# EAGLE design DUAL CHANNEL REAY DRIVER (EAGLE 6.1)
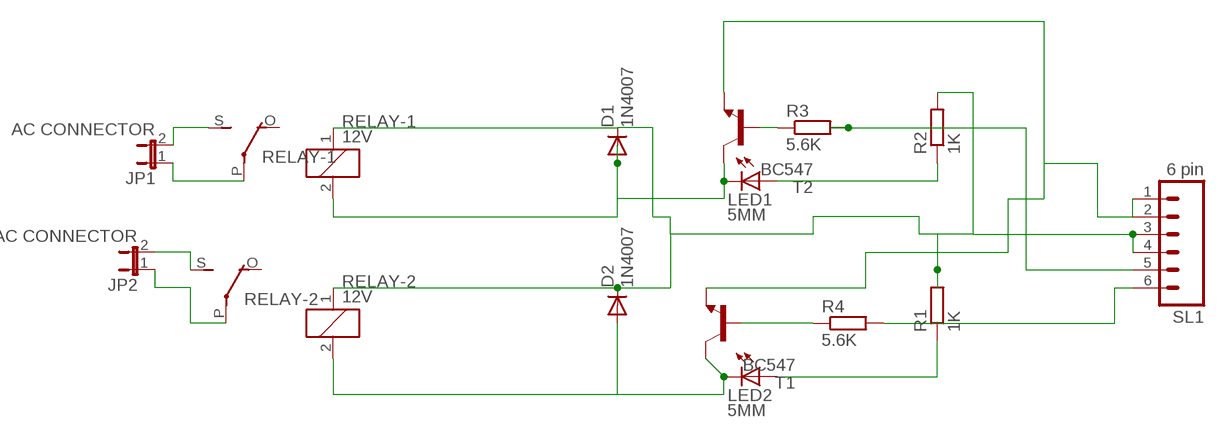
[diagram p0: schematic, sheet 1]

## Parts
D1  1N4007  1N4004  [DO41-10]
D2  1N4007  1N4004  [DO41-10]
JP1  AC CONNECTOR  JP1E  [JP1]
JP2  AC CONNECTOR  JP1E  [JP1]
LED1  5MM  LED5MM  [LED5MM]
LED2  5MM  LED5MM  [LED5MM]
R1  1K  R-EU_0204/7  [0204/7]
R2  1K  R-EU_0204/7  [0204/7]
R3  5.6K  R-EU_0204/7  [0204/7]
R4  5.6K  R-EU_0204/7  [0204/7]
RELAY-1  12V  G5L  [G5LE]
RELAY-2  12V  G5L  [G5LE]
SL1  6 pin  M06  [06P]
T1  BC547  [TO92]
T2  BC547  [TO92]

## Nets
N$1: D1.A LED1.K(C) RELAY-1.2 T2.3(C)
N$2: D1.C D2.C R1.2 R2.2 RELAY-1.1 RELAY-2.1 SL1.3 SL1.4
N$3: JP2.2 RELAY-2.S(2:S)
N$5: R4.1 T1.2(B)
N$6: R3.1 T2.2(B)
N$7: LED1.A R2.1
N$8: LED2.A R1.1
N$9: JP1.2 RELAY-1.S(2:S)
N$10: JP1.1 RELAY-1.P(2:P)
N$13: JP2.1 RELAY-2.P(2:P)
N$16: SL1.1 SL1.2 T1.1(E) T2.1(E)
N$17: R3.2 SL1.5
N$18: R4.2 SL1.6
N$20: D2.A LED2.K(C) RELAY-2.2 T1.3(C)
Unconnected: RELAY-1.O(2:O) RELAY-2.O(2:O)

## Library data of the parts
D1 D2 = diode:1N4004: DIODE general purpose rectifier, 1 A
JP1 JP2 = jumper:JP1E: JUMPER
LED1 LED2 = led:LED: LED OSRAM: - CHIPLED LG R971, LG N971, LY N971, LG Q971, LY Q971, LO R971, LY R971 LH N974, LH R974 LS Q976, LO Q976, LY Q976 LO Q996 - Hyper CHIPLED LW Q18S LB Q993, LB Q99A, LB R99A - SideLED LS A670, LO A670, LY A670, LG A670, LP A670 LB A673, LV A673, LT A673, LW A673 LH A674 LY A675 LS A676, LA A676, LO A676, LY A676, LW A676 LS A679, LY A679, LG A679 - Hyper Micro SIDELED® LS Y876, LA Y876, LO Y876, LY Y876 LT Y87S - SmartLED LW L88C, LW L88S LB L89C, LB L89S, LG L890 LS L89K, LO L89K, LY L89K LS L896, LA L896, LO L896, LY L896 - TOPLED LS T670, LO T670, LY T670, LG T670, LP T670 LSG T670, LSP T670, LSY T670, LOP T670, LYG T670 LG T671, LOG T671, LSG T671 LB T673, LV T673, LT T673, LW T673 LH T674 LS T676, LA T676, LO T676, LY T676, LB T676, LH T676, LSB T676, LW T676 LB T67C, LV T67C, LT T67C, LS T67K, LO T67K, LY T67K, LW E67C LS E67B, LA E67B, LO E67B, LY E67B, LB E67C, LV E67C, LT E67C LW T67C LS T679, LY T679, LG T679 LS T770, LO T770, LY T770, LG T770, LP T770 LB T773, LV T773, LT T773, LW T773 LH T774 LS E675, LA E675, LY E675, LS T675 LS T776, LA T776, LO T776, LY T776, LB T776 LHGB T686 LT T68C, LB T68C - Hyper Mini TOPLED® LB M676 - Mini TOPLED Santana® LG M470 LS M47K, LO M47K, LY M47K Source: http://www.osram.convergy.de LUXEON: - LUMILED® LXK2-PW12-R00, LXK2-PW12-S00, LXK2-PW14-U00, LXK2-PW14-V00 LXK2-PM12-R00, LXK2-PM12-S00, LXK2-PM14-U00 LXK2-PE12-Q00, LXK2-PE12-R00, LXK2-PE12-S00, LXK2-PE14-T00, LXK2-PE14-U00 LXK2-PB12-K00, LXK2-PB12-L00, LXK2-PB12-M00, LXK2-PB14-N00, LXK2-PB14-P00, LXK2-PB14-Q00 LXK2-PR12-L00, LXK2-PR12-M00, LXK2-PR14-Q00, LXK2-PR14-R00 LXK2-PD12-Q00, LXK2-PD12-R00, LXK2-PD12-S00 LXK2-PH12-R00, LXK2-PH12-S00 LXK2-PL12-P00, LXK2-PL12-Q00, LXK2-PL12-R00 Source: www.luxeon.com KINGBRIGHT: KA-3528ASYC Source: www.kingbright.com
R1-R4 = rcl:R-EU_: RESISTOR, European symbol
RELAY-1 RELAY-2 = relay:G5L: RELAY 1 x switch, 10 A/120 V AC, 8 A/30 V ADC, Omron; OC_FARNELL: unknown; OC_NEWARK: unknown
SL1 = con-amp-quick:M06: AMP QUICK CONNECTOR; OC_FARNELL: unknown; OC_NEWARK: unknown
T1 T2 = transistor:BC547: NPN TRANSISTOR

## Board
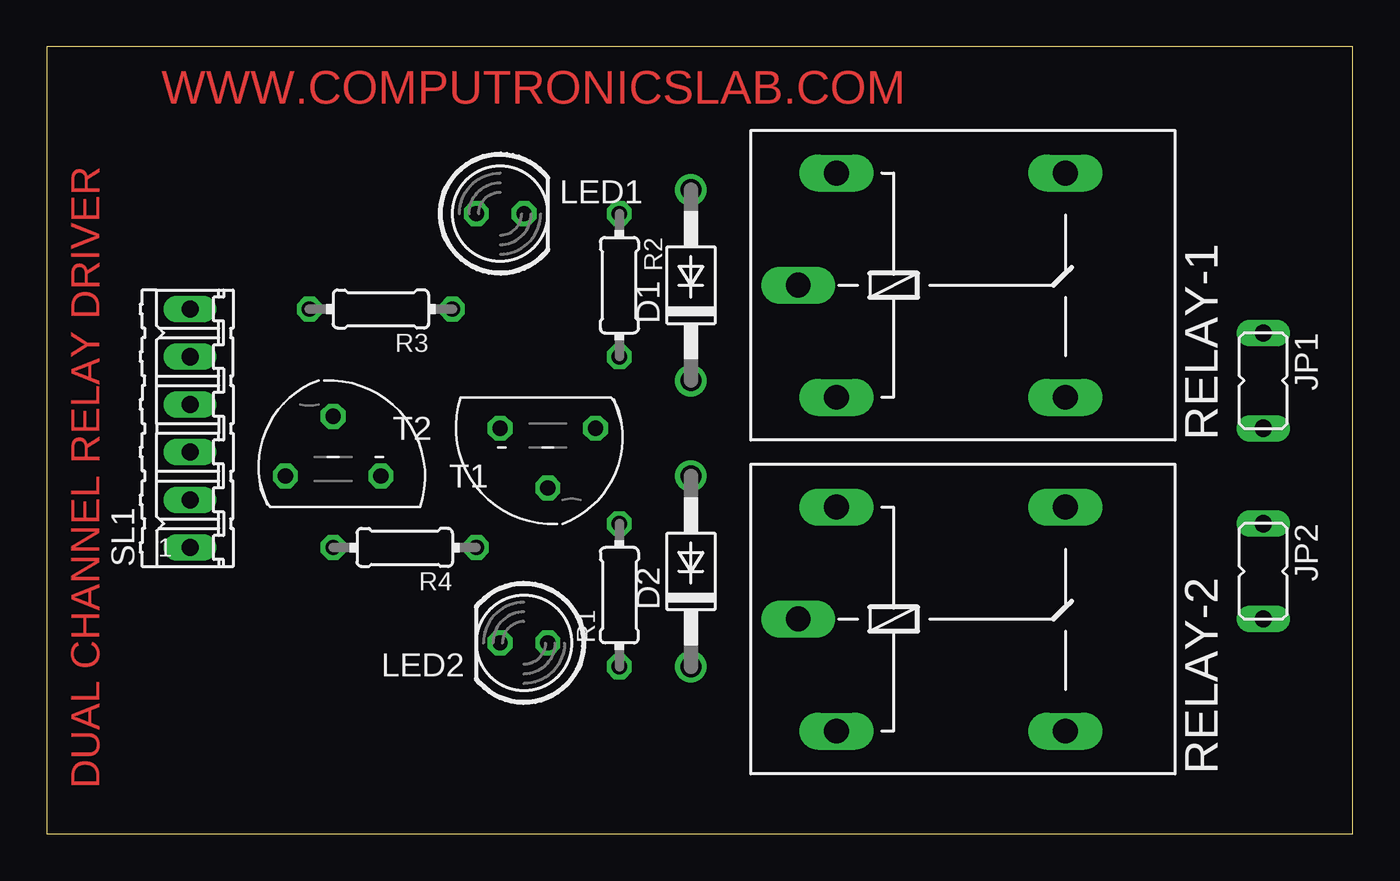
[diagram p1: board, top side]
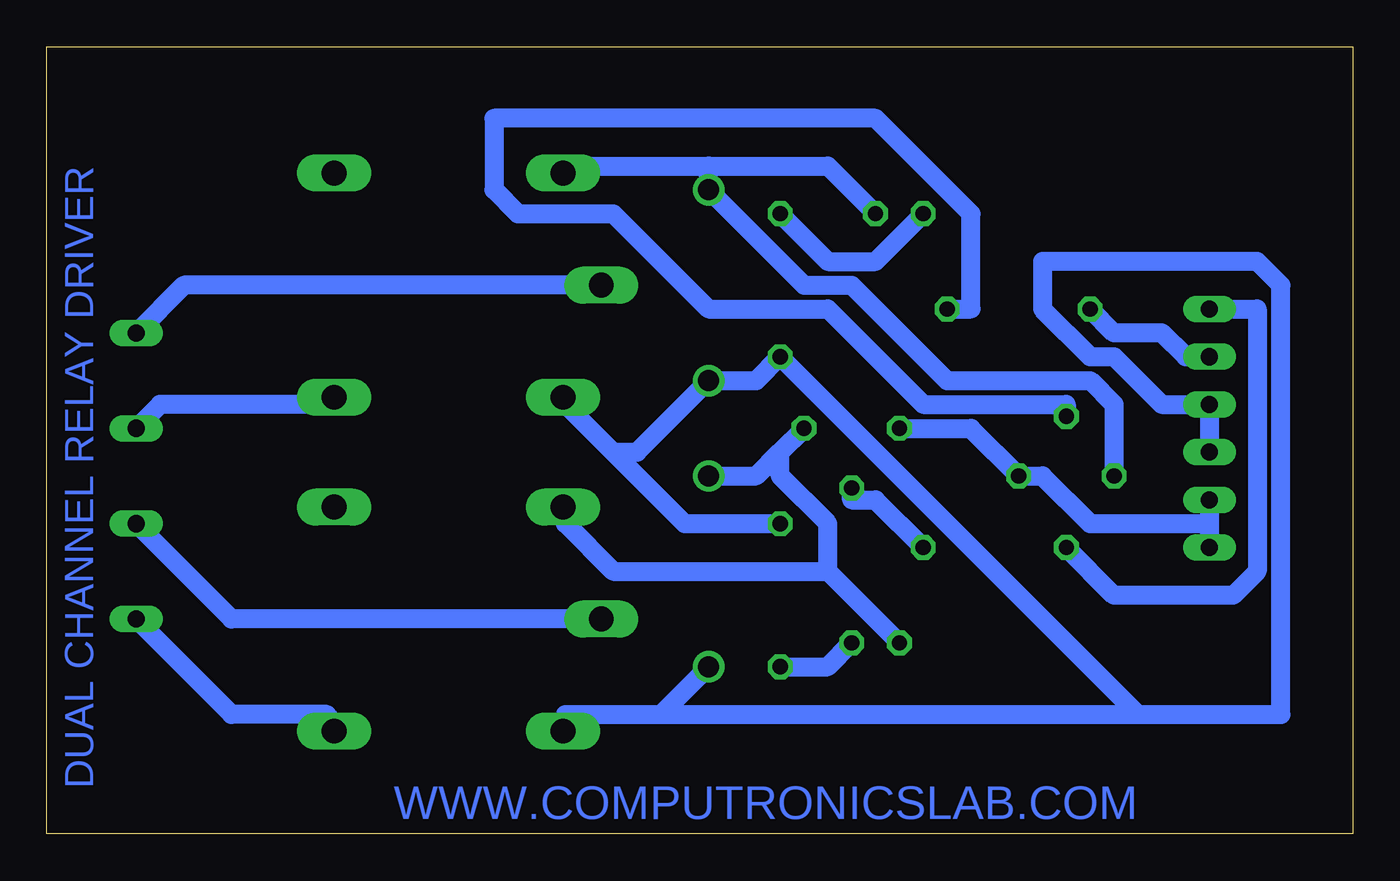
[diagram p2: board, bottom side, seen from below]

Size 69.52 x 41.9 mm. Coordinates in mm from the lower left corner, seen from the top.
Outline: 0,0 69.52,0 69.52,41.9 0,41.9 0,0
Copper layers (1*16): Top 0.035mm / dielectric 1.5mm / Bottom 0.035mm
Design rules: minimum track width 40mil, minimum drill 24mil, track to track 8mil, track to pad 8mil, pad to pad 8mil, via to via 8mil, smd to smd 8mil, copper to edge 40mil, drill to drill 8mil, minimum pad ring 10mil, minimum via ring 8mil, stop-mask expansion 4mil, vias tented up to drill 0mil, thermal gap 10mil

### Footprints (pad centres in the part's own frame; a part is rotated, then mirrored left to right if it is on the bottom)
DO41-10 = drill 1.118: A 5.08,0; C -5.08,0
JP1 = drill 0.914 long: 1 0,-2.54; 2 0,2.54
LED5MM = drill 0.813 octagon: A -1.27,0; K 1.27,0
0204/7 = drill 0.813 octagon: 1 -3.81,0; 2 3.81,0
G5LE = drill 1.321 long: 1 -7.493,-5.969; 2 -7.493,5.969; O 4.699,5.969; P -9.525,0; S 4.699,-5.969
06P = drill 0.914 long: 1 -6.35,0; 2 -3.81,0; 3 -1.27,0; 4 1.27,0; 5 3.81,0; 6 6.35,0
TO92 = drill 0.813 octagon: 1 2.54,-1.27; 2 0,1.905; 3 -2.54,-1.27

### Placement (x,y rotation side)
D1  34.29,29.21 90 top
D2  34.29,13.97 90 top
JP1  64.77,24.13 180 top
JP2  64.77,13.97 180 top
LED1  24.13,33.02 0 top
LED2  25.4,10.16 180 top
R1  30.48,12.7 90 top
R2  30.48,29.21 270 top
R3  17.78,27.94 180 top
R4  19.05,15.24 180 top
RELAY-1  49.53,29.21 0 top
RELAY-2  49.53,11.43 0 top
SL1  7.62,21.59 90 top
T1  26.67,20.32 180 top
T2  15.24,20.32 0 top

### Tracks (layer width: path | path; a pad name or v marks a point on that pad's centre or on a via)
N$1
  Bottom 1.016: LED1.K 27.94,35.56 34.29,35.56 | 34.29,35.56 41.91,35.56 RELAY-1.2 | T2.3 12.7,22.86 13.97,24.13 21.59,24.13 26.67,29.21 29.21,29.21 D1.A 34.29,35.56
N$2
  Bottom 1.016: R1.2 35.56,16.51 39.37,20.32 | 39.37,20.32 41.91,22.86 RELAY-1.1 | 39.37,20.32 38.1,20.32 D1.C 31.75,24.13 R2.2 11.43,6.35 | SL1.3 SL1.4 10.16,22.86 12.7,25.4 13.97,25.4 16.51,27.94 16.51,30.48 5.08,30.48 3.81,29.21 3.81,6.35 11.43,6.35 | 36.83,6.35 D2.C | 36.83,6.35 41.91,6.35 RELAY-2.1 | 36.83,6.35 11.43,6.35
N$3
  Bottom 1.016: JP2.2 59.69,6.35 54.61,6.35 RELAY-2.S
N$5
  Bottom 1.016: R4.1 25.4,17.78 26.67,17.78 T1.2
N$6
  Bottom 1.016: R3.1 20.32,27.94 20.32,33.02 25.4,38.1 45.72,38.1 45.72,34.29 44.45,33.02 39.37,33.02 34.29,27.94 27.94,27.94 22.86,22.86 15.24,22.86 T2.2
N$7
  Bottom 1.016: LED1.A 25.4,30.48 27.94,30.48 R2.1
N$8
  Bottom 1.016: LED2.A 27.94,8.89 R1.1
N$9
  Bottom 1.016: JP1.2 63.5,22.86 54.61,22.86 RELAY-1.S
N$10
  Bottom 1.016: JP1.1 62.23,29.21 RELAY-1.P
N$13
  Bottom 1.016: JP2.1 59.69,11.43 RELAY-2.P
N$16
  Bottom 1.016: SL1.2 7.62,16.51 | 7.62,16.51 SL1.1 | T1.1 20.32,21.59 T2.1 16.51,19.05 13.97,16.51 7.62,16.51
N$17
  Bottom 1.016: R3.2 12.7,26.67 10.16,26.67 8.89,25.4 SL1.5
N$18
  Bottom 1.016: R4.2 12.7,12.7 6.35,12.7 5.08,13.97 5.08,27.94 SL1.6
N$20
  Bottom 1.016: 30.48,20.32 31.75,19.05 D2.A | 30.48,20.32 T1.3 | 27.94,13.97 LED2.K | 27.94,13.97 39.37,13.97 41.91,16.51 RELAY-2.2 | 30.48,20.32 30.48,19.05 27.94,16.51 27.94,13.97

### Text on the board
Top: WWW.COMPUTRONICSLAB.COM | DUAL CHANNEL RELAY DRIVER
Bottom: DUAL CHANNEL RELAY DRIVER | WWW.COMPUTRONICSLAB.COM